# EAGLE design Glint module (rev A) - hand solder (EAGLE 6.4)
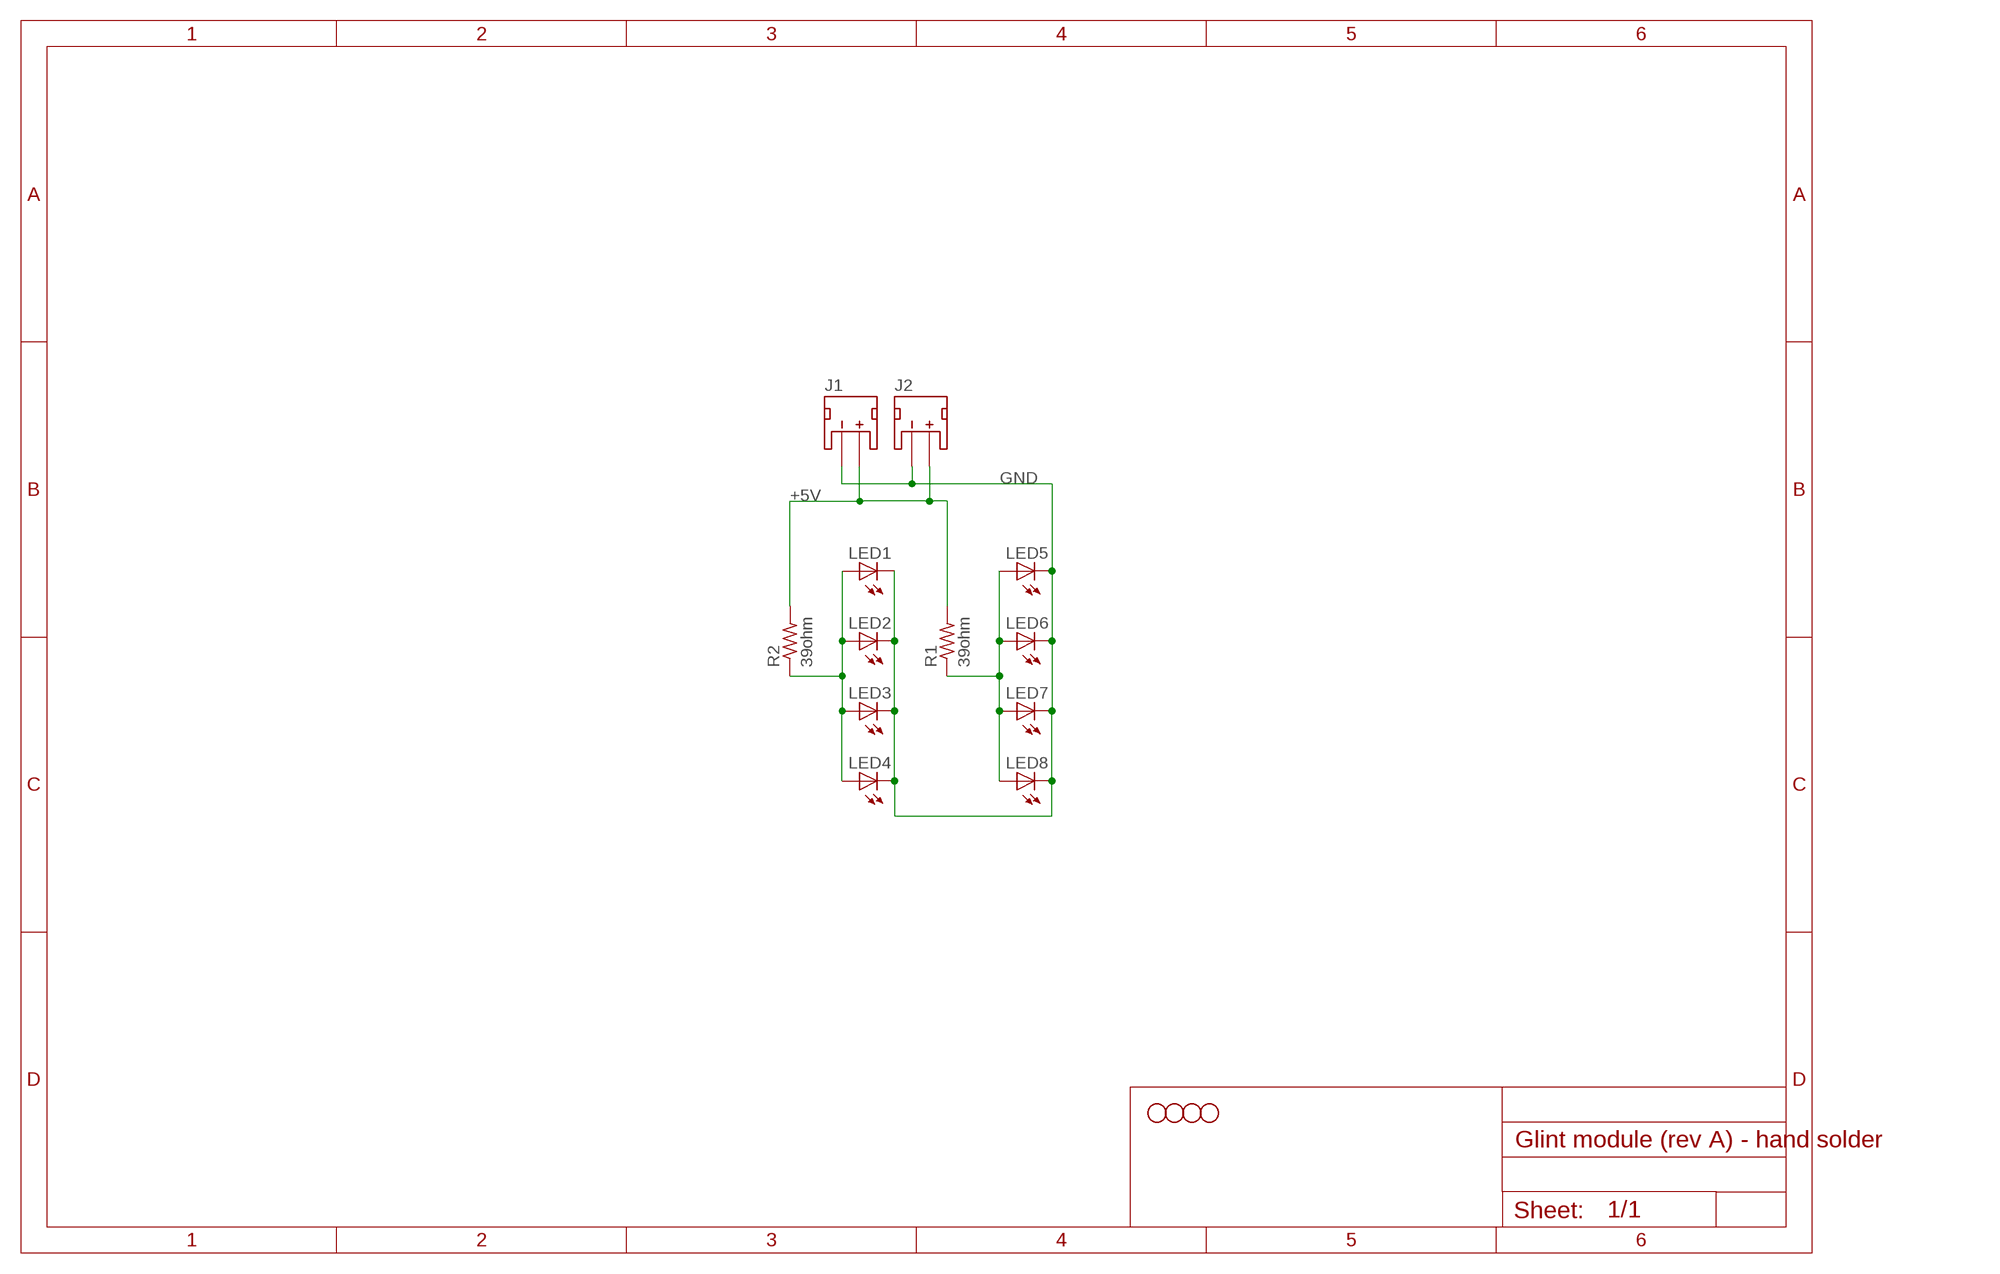
[diagram p0: schematic, sheet 1]

## Parts
J1  JST_2MM_MALE  [JST-2-SMD]
J2  JST_2MM_MALE  [JST-2-SMD]
LED1  LED5MM  [LED5MM]
LED2  LED5MM  [LED5MM]
LED3  LED5MM  [LED5MM]
LED4  LED5MM  [LED5MM]
LED5  LED5MM  [LED5MM]
LED6  LED5MM  [LED5MM]
LED7  LED5MM  [LED5MM]
LED8  LED5MM  [LED5MM]
R1  39ohm  R-US_0309/10  [0309/10]
R2  39ohm  R-US_0309/10  [0309/10]
STANDOFF1  STAND-OFF  [STAND-OFF]
STANDOFF2  STAND-OFF  [STAND-OFF]
STANDOFF3  STAND-OFF  [STAND-OFF]
STANDOFF4  STAND-OFF  [STAND-OFF]

## Nets
+5V: J1.2(+) J2.2(+) R1.2 R2.2
GND: J1.1(-) J2.1(-) LED1.K(C) LED2.K(C) LED3.K(C) LED4.K(C) LED5.K(C) LED6.K(C) LED7.K(C) LED8.K(C)
N$1: LED1.A LED2.A LED3.A LED4.A R2.1
N$3: LED5.A LED6.A LED7.A LED8.A R1.1
Unconnected: J1.NC1(PAD1) J1.NC2(PAD2) J2.NC1(PAD1) J2.NC2(PAD2)

## Library data of the parts
J1 J2 = SparkFun-Connectors:JST_2MM_MALE: Mates to single-cell LiPo batteries. CONN-08352; PROD_ID: CONN-08352
LED1-LED8 = SparkFun-LED:LED: LEDs Standard schematic elements and footprints for 5mm, 3mm, 1206, and 0603 sized LEDs. 5mm - Spark Fun Electronics SKU : COM-00529 (and others)
R1 R2 = resistor:R-US_: RESISTOR, American symbol
STANDOFF1-STANDOFF4 = SparkFun-Electromechanical:STAND-OFF: #4 Stand Off This is the mechanical footprint for a #4 phillips button head screw. Use the keepout ring to avoid running the screw head into surrounding components. SKU : PRT-00447

## Board
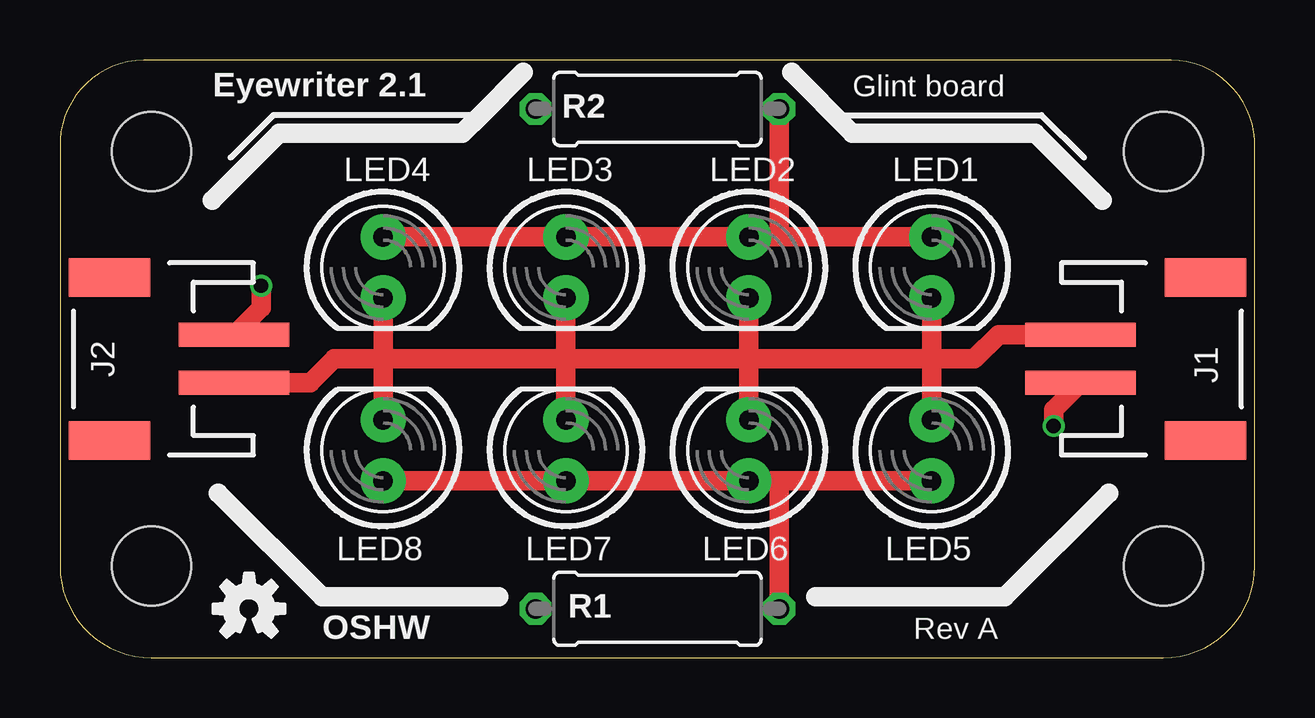
[diagram p1: board, top side]
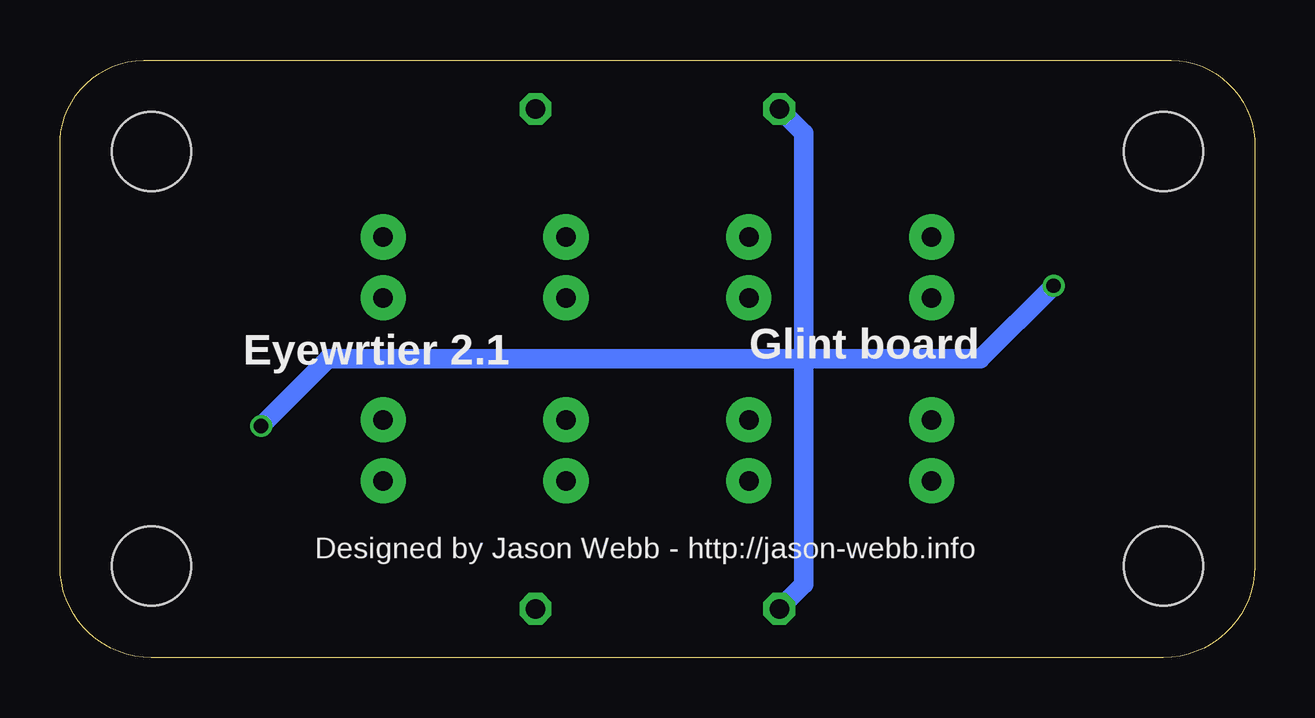
[diagram p2: board, bottom side, seen from below]

Size 49.78 x 24.9 mm. Coordinates in mm from the lower left corner, seen from the top.
Outline: 3.81,0 45.97,0 arc90 49.78,3.81 49.78,21.59 arc90 45.97,24.89 3.81,24.89 arc90 0,21.59 0,3.81 arc90 3.81,0
Copper layers (1*16): Top 0.035mm / dielectric 1.5mm / Bottom 0.035mm
Design rules "Fusion_eagle_rule_v1.1": minimum track width 6mil, minimum drill 12mil, track to track 6mil, track to pad 6mil, pad to pad 6mil, via to via 6mil, smd to smd 0mil, copper to edge 10mil, drill to drill 10mil, minimum pad ring 10mil, minimum via ring 6mil, stop-mask expansion 2mil, vias tented up to drill 100mil, thermal gap 10mil

### Footprints (pad centres in the part's own frame; a part is rotated, then mirrored left to right if it is on the bottom)
JST-2-SMD = smd 1 x 4.6: 1 -1,-3.7; 2 1,-3.7 | smd 1.6 x 3.4: NC1 -3.4,1.5; NC2 3.4,1.5
LED5MM = drill 0.813 pad 1.88: A -1.27,0; K 1.27,0
0309/10 = drill 0.813 octagon: 1 -5.08,0; 2 5.08,0
STAND-OFF = hole 3.302: 0,0

### Placement (x,y rotation side)
J1  46.23,12.45 270 top
J2  3.56,12.45 90 top
LED1  36.32,16.26 270 top
LED2  28.7,16.26 270 top
LED3  21.08,16.26 270 top
LED4  13.46,16.26 270 top
LED5  36.32,8.64 90 top
LED6  28.7,8.64 90 top
LED7  21.08,8.64 90 top
LED8  13.46,8.64 90 top
R1  24.89,2.03 180 top
R2  24.89,22.86 180 top
STANDOFF1  3.81,3.81 0 top
STANDOFF2  3.81,21.08 0 top
STANDOFF3  45.97,3.81 0 top
STANDOFF4  45.97,21.08 0 top
U$1  [OSHW-LOGO-S]  7.87,2.03 0 top

### Tracks (layer width: path | path; a pad name or v marks a point on that pad's centre or on a via)
+5V  (via drill 0.6)
  Top 0.813: J1.2 41.4,10.32 v41.4,9.65 | v8.38,15.49 8.38,14.57 J2.2
  Bottom 0.813: v41.4,9.65 38.61,12.45 18.8,12.45 | 18.8,12.45 11.43,12.45 v8.38,15.49 | R2.2 18.8,21.84 18.8,12.45 | R1.2 18.8,3.05 18.8,12.45
GND
  Top 0.813: J2.1 10.43,11.45 11.43,12.45 13.21,12.45 | 13.21,12.45 13.72,12.45 | 13.72,12.45 21.08,12.45 | 21.08,12.45 28.45,12.45 | 28.45,12.45 28.7,12.45 | 28.7,12.45 36.32,12.45 | 36.32,12.45 38.1,12.45 39.12,13.46 42.51,13.46 J1.1 | LED1.K 36.32,12.45 | LED2.K 28.7,12.7 28.45,12.45 | LED3.K 21.08,12.45 | LED4.K 13.46,12.7 13.21,12.45 | LED8.K 13.46,12.19 13.72,12.45 | LED7.K 21.08,12.45 | LED6.K 28.7,12.45 | LED5.K 36.32,12.45
N$1
  Top 0.813: LED4.A LED3.A LED2.A 29.97,17.53 | 29.97,17.53 LED1.A | R2.1 29.97,17.53
N$3
  Top 0.813: LED8.A LED7.A LED6.A 29.97,7.37 | 29.97,7.37 LED5.A | R1.1 29.97,7.37

### Text on the board
tPlace: Eyewriter 2.1 | Glint board | OSHW | Rev A
bPlace: Glint board | Eyewrtier 2.1 | Designed by Jason Webb - http://jason-webb.info